# Altium schematic sheet QDRII_power.SchDoc: QDRII_power
size A4; Date: 18/06/2014; DrawnBy: J. Gabriel R.E.; Organization: Seven Solutions S.L.; Address1: C/Baza, Parcela 19, Nave 3; Address2: Polнgono Ind. Juncaril; Address3: 18210-Peligros-Granada; Address4: Spain; Revision: 3.4; SheetNumber: 21; SheetTotal: 23; WebAddress: www.sevensols.com; Project: White Rabbit; ProjectName: White Rabbit
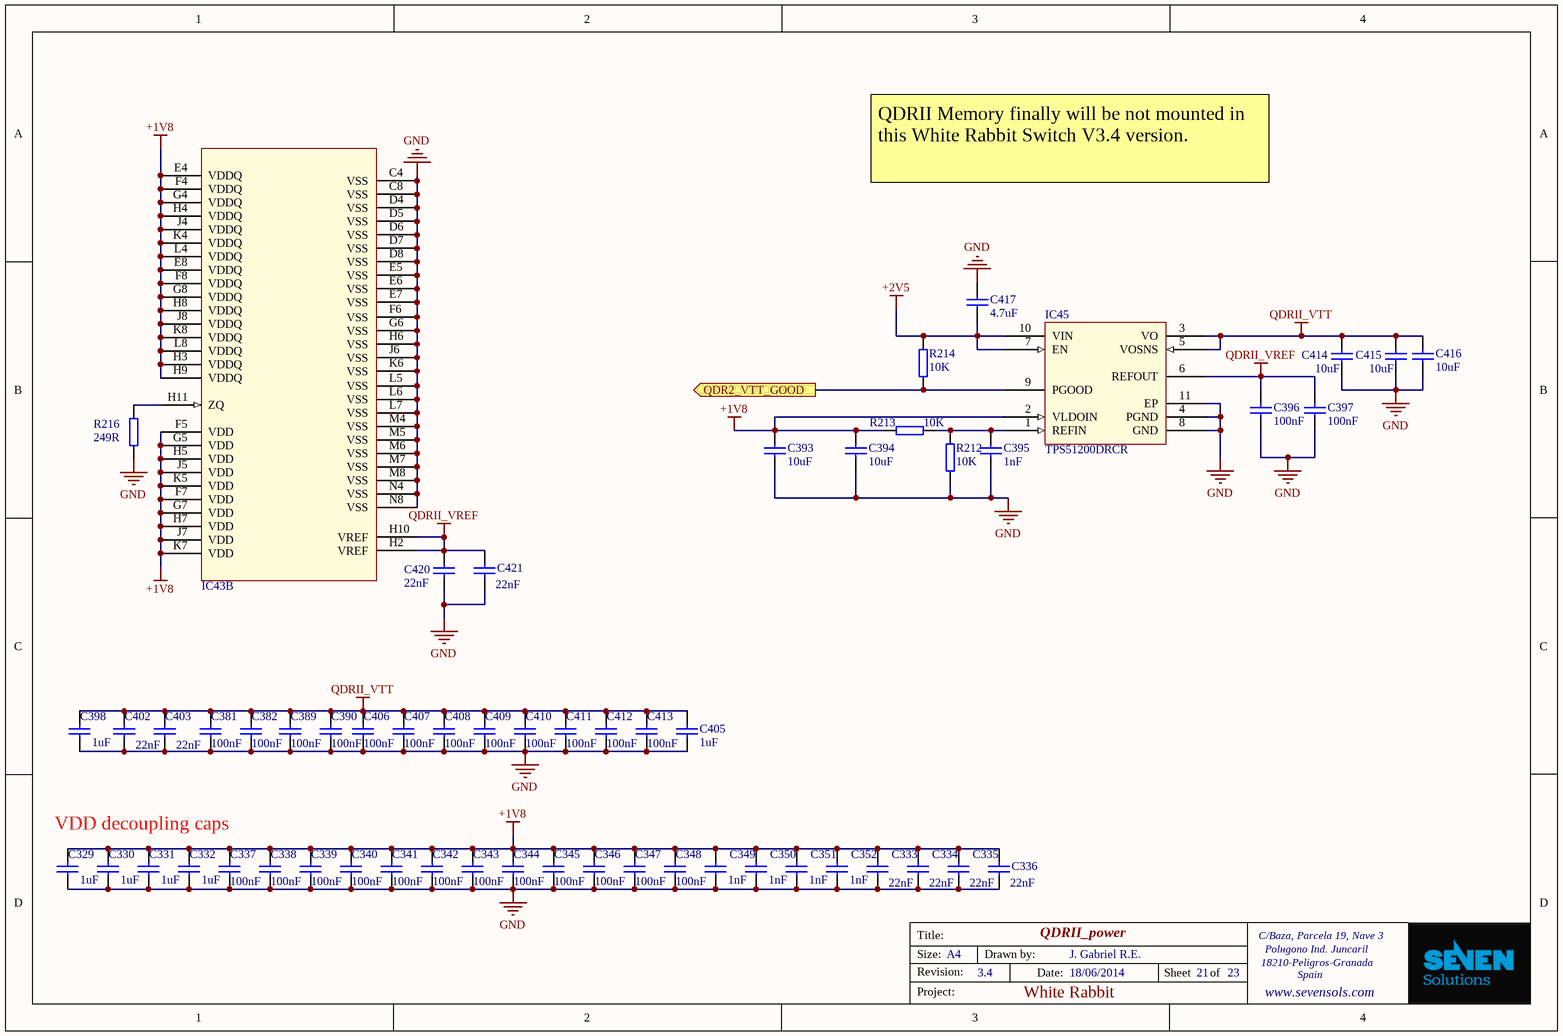
[diagram p0: QDRII_power.SchDoc]

## Parts
C329  1uF  [CC1005-0402]
C330  1uF  [CC1005-0402]
C331  1uF  [CC1005-0402]
C332  1uF  [CC1005-0402]
C333  22nF  [CC1005-0402]
C334  22nF  [CC1005-0402]
C335  22nF  [CC1005-0402]
C336  22nF  [CC1005-0402]
C337  100nF  [CC1005-0402]
C338  100nF  [CC1005-0402]
C339  100nF  [CC1005-0402]
C340  100nF  [CC1005-0402]
C341  100nF  [CC1005-0402]
C342  100nF  [CC1005-0402]
C343  100nF  [CC1005-0402]
C344  100nF  [CC1005-0402]
C345  100nF  [CC1005-0402]
C346  100nF  [CC1005-0402]
C347  100nF  [CC1005-0402]
C348  100nF  [CC1005-0402]
C349  1nF  [CC1005-0402]
C350  1nF  [CC1005-0402]
C351  1nF  [CC1005-0402]
C352  1nF  [CC1005-0402]
C381  100nF  [CC1005-0402]
C382  100nF  [CC1005-0402]
C389  100nF  [CC1005-0402]
C390  100nF  [CC1005-0402]
C393  10uF  [CC1608-0603]
C394  10uF  [CC1608-0603]
C395  1nF  [CC1005-0402]
C396  100nF  [CC1005-0402]
C397  100nF  [CC1005-0402]
C398  1uF  [CC1005-0402]
C402  22nF  [CC1005-0402]
C403  22nF  [CC1005-0402]
C405  1uF  [CC1005-0402]
C406  100nF  [CC1005-0402]
C407  100nF  [CC1005-0402]
C408  100nF  [CC1005-0402]
C409  100nF  [CC1005-0402]
C410  100nF  [CC1005-0402]
C411  100nF  [CC1005-0402]
C412  100nF  [CC1005-0402]
C413  100nF  [CC1005-0402]
C414  10uF  [CC1608-0603]
C415  10uF  [CC1608-0603]
C416  10uF  [CC1608-0603]
C417  4.7uF  [CC1608-0603]
C420  22nF  [CC1005-0402]
C421  22nF  [CC1005-0402]
IC43  CY7C1314KV18-250BZC  [BGA165C100P11X15_1300X1500X140]  (value not drawn)  (part B of 2)
IC45  TPS51200DRCR  [SON50P300X300X100-11N-R175X250]
R212  10k  [0402]
R213  10k  [0402]
R214  10k  [0402]
R216  249R  [0402]

## Ports
QDR2_VTT_GOOD (out)

## Nets
+1V8: C329.2 C330.2 C331.2 C332.2 C333.2 C334.2 C335.2 C336.2 C337.1 C338.1 C339.1 C340.1 C341.1 C342.1 C343.1 C344.1 C345.1 C346.1 C347.1 C348.1 C349.2 C350.2 C351.2 C352.2 C393.2 C394.2 IC43.E4(VDDQ) IC43.E8(VDDQ) IC43.F4(VDDQ) IC43.F5(VDD) IC43.F7(VDD) IC43.F8(VDDQ) IC43.G4(VDDQ) IC43.G5(VDD) IC43.G7(VDD) IC43.G8(VDDQ) IC43.H3(VDDQ) IC43.H4(VDDQ) IC43.H5(VDD) IC43.H7(VDD) IC43.H8(VDDQ) IC43.H9(VDDQ) IC43.J4(VDDQ) IC43.J5(VDD) IC43.J7(VDD) IC43.J8(VDDQ) IC43.K4(VDDQ) IC43.K5(VDD) IC43.K7(VDD) IC43.K8(VDDQ) IC43.L4(VDDQ) IC43.L8(VDDQ) IC45.2(VLDOIN) R213.2
+2V5: C417.1 IC45.7(EN) IC45.10(VIN) R214.2
GND: C329.1 C330.1 C331.1 C332.1 C333.1 C334.1 C335.1 C336.1 C337.2 C338.2 C339.2 C340.2 C341.2 C342.2 C343.2 C344.2 C345.2 C346.2 C347.2 C348.2 C349.1 C350.1 C351.1 C352.1 C381.2 C382.2 C389.2 C390.2 C393.1 C394.1 C395.1 C396.2 C397.2 C398.1 C402.1 C403.1 C405.1 C406.2 C407.2 C408.2 C409.2 C410.2 C411.2 C412.2 C413.2 C414.1 C415.1 C416.1 C417.2 C420.1 C421.1 IC43.C4(VSS) IC43.C8(VSS) IC43.D4(VSS) IC43.D5(VSS) IC43.D6(VSS) IC43.D7(VSS) IC43.D8(VSS) IC43.E5(VSS) IC43.E6(VSS) IC43.E7(VSS) IC43.F6(VSS) IC43.G6(VSS) IC43.H6(VSS) IC43.J6(VSS) IC43.K6(VSS) IC43.L5(VSS) IC43.L6(VSS) IC43.L7(VSS) IC43.M4(VSS) IC43.M5(VSS) IC43.M6(VSS) IC43.M7(VSS) IC43.M8(VSS) IC43.N4(VSS) IC43.N8(VSS) IC45.4(PGND) IC45.8(GND) IC45.11(EP) R212.1 R216.1
QDRII_VREF: C396.1 C397.1 C420.2 C421.2 IC43.H2(VREF) IC43.H10(VREF) IC45.6(REFOUT)
QDRII_VTT: C381.1 C382.1 C389.1 C390.1 C398.2 C402.2 C403.2 C405.2 C406.1 C407.1 C408.1 C409.1 C410.1 C411.1 C412.1 C413.1 C414.2 C415.2 C416.2 IC45.3(VO) IC45.5(VOSNS)
QDR2_VTT_GOOD: IC45.9(PGOOD) R214.1 ; port QDR2_VTT_GOOD
NetC395_2: C395.2 IC45.1(REFIN) R212.2 R213.1
NetIC43_H11: IC43.H11(ZQ) R216.2

## Notes on the sheet
- QDRII Memory finally will be not mounted in this White Rabbit Switch V3.4 version.
- VDD decoupling caps
- Title:
- Size:
- Revision:
- A4
- Drawn by:
- Date:
- Sheet
- of
- Project:

## Library data of the parts
C329-C332 C398 C405 = CC0402_1UF_16V_10%_X5R: Capacitor; Manufacturer1: TDK; Manufacturer1 PN: C1005X5R1C105K; TC: X5R; Tolerance: ±10%; Voltage: 16V; Published: 8-Jun-2000; LatestRevisionDate: 17-Jul-2002; LatestRevisionNote: Re-released for DXP Platform.; PackageReference: RAD-0.3; Publisher: Altium Limited; Distributor1: Digikey; Distributor1 PN: 445-4978-1-ND; Case: 0402; Value: 1uF
C333-C336 C402 C403 C420 C421 = CC0402_22NF_25V_10%_X7R: Capacitor; Manufacturer1: TDK; Manufacturer1 PN: C1005X7R1E223K; TC: X7R; Tolerance: ±10%; Voltage: 25V; Published: 8-Jun-2000; LatestRevisionDate: 17-Jul-2002; LatestRevisionNote: Re-released for DXP Platform.; PackageReference: RAD-0.3; Publisher: Altium Limited; Distributor1: Digikey; Distributor1 PN: 445-1261-1-ND; Case: 0402; Value: 22nF
C337-C348 C381 C382 C389 C390 C396 C397 C406-C413 = CC0402_100NF_16V_10%_X7R: Capacitor; Manufacturer1: TDK; Manufacturer1 PN: C1005X7R1C104K; TC: X7R; Tolerance: ±10%; Voltage: 16V; Published: 8-Jun-2000; LatestRevisionDate: 17-Jul-2002; LatestRevisionNote: Re-released for DXP Platform.; PackageReference: RAD-0.3; Publisher: Altium Limited; Distributor1: Digikey; Distributor1 PN: 445-4952-1-ND; Case: 0402; Value: 100nF
C349-C352 C395 = CC0402_1NF_25V_10%_X7R: Capacitor; Manufacturer1: TDK; Manufacturer1 PN: C1005X7R1E102K; TC: X7R; Tolerance: ±10%; Voltage: 25V; Published: 8-Jun-2000; LatestRevisionDate: 17-Jul-2002; LatestRevisionNote: Re-released for DXP Platform.; PackageReference: RAD-0.3; Publisher: Altium Limited; Distributor1: Digikey; Distributor1 PN: 445-4924-1-ND; Case: 0402; Value: 1nF
C393 C394 C414-C416 = CC0603_10UF_6.3V_20%_X5R: Capacitor; Manufacturer1: TDK; Manufacturer1 PN: C1608X5R0J106M; TC: X5R; Tolerance: ±20%; Voltage: 6.3V; Published: 8-Jun-2000; LatestRevisionDate: 17-Jul-2002; LatestRevisionNote: Re-released for DXP Platform.; PackageReference: RAD-0.3; Publisher: Altium Limited; Distributor1: Digikey; Distributor1 PN: 445-4112-1-ND; Case: 0603; Value: 10uF
C417 = CC0603_4.7UF_10V_10%_X5R: Capacitor; Manufacturer1: TDK; Manufacturer1 PN: C1608X5R1A475K; TC: X5R; Tolerance: ±10%; Voltage: 10V; Published: 8-Jun-2000; LatestRevisionDate: 17-Jul-2002; LatestRevisionNote: Re-released for DXP Platform.; PackageReference: RAD-0.3; Publisher: Altium Limited; Distributor1: Digikey; Distributor1 PN: 445-5170-1-ND; Case: 0603; Value: 4.7uF
IC43 = CY7C1314CV18: 18-Mbit (512Kx36) QDRII SRAM 2-Word Burst Architecture; Value: CY7C1314KV18-250BZC; Distributor1 PN: CY7C1314KV18-250BZC -ND; Distributor1: Digikey
IC45 = TPS51200: Sink/Source DDR Termination Regulator; Value: TPS51200DRCR; Distributor1 PN: 296-26978-1-ND; Distributor1: Digikey
R212-R214 = R0402_10K_±1%_0.1W_100PPM: SMD Resistor; Manufacturer1: Panasonic; Manufacturer1 PN: ERJ-2RKF1002X; TCR: 100ppm; Power Rating: 0.1W; Tolerance: ±1%; Case: 0402; Distributor1: DigiKey; Distributor1 PN: P10.0KLCT-ND; Value: 10K
R216 = R0402_249R_±1%_0.1W_100PPM: SMD Resistor; Manufacturer1: Panasonic; Manufacturer1 PN: ERJ-2RKF2490X; TCR: 100ppm; Power Rating: 0.1W; Tolerance: ±1%; Case: 0402; Distributor1: DigiKey; Distributor1 PN: P249LCT-ND; Value: 249R